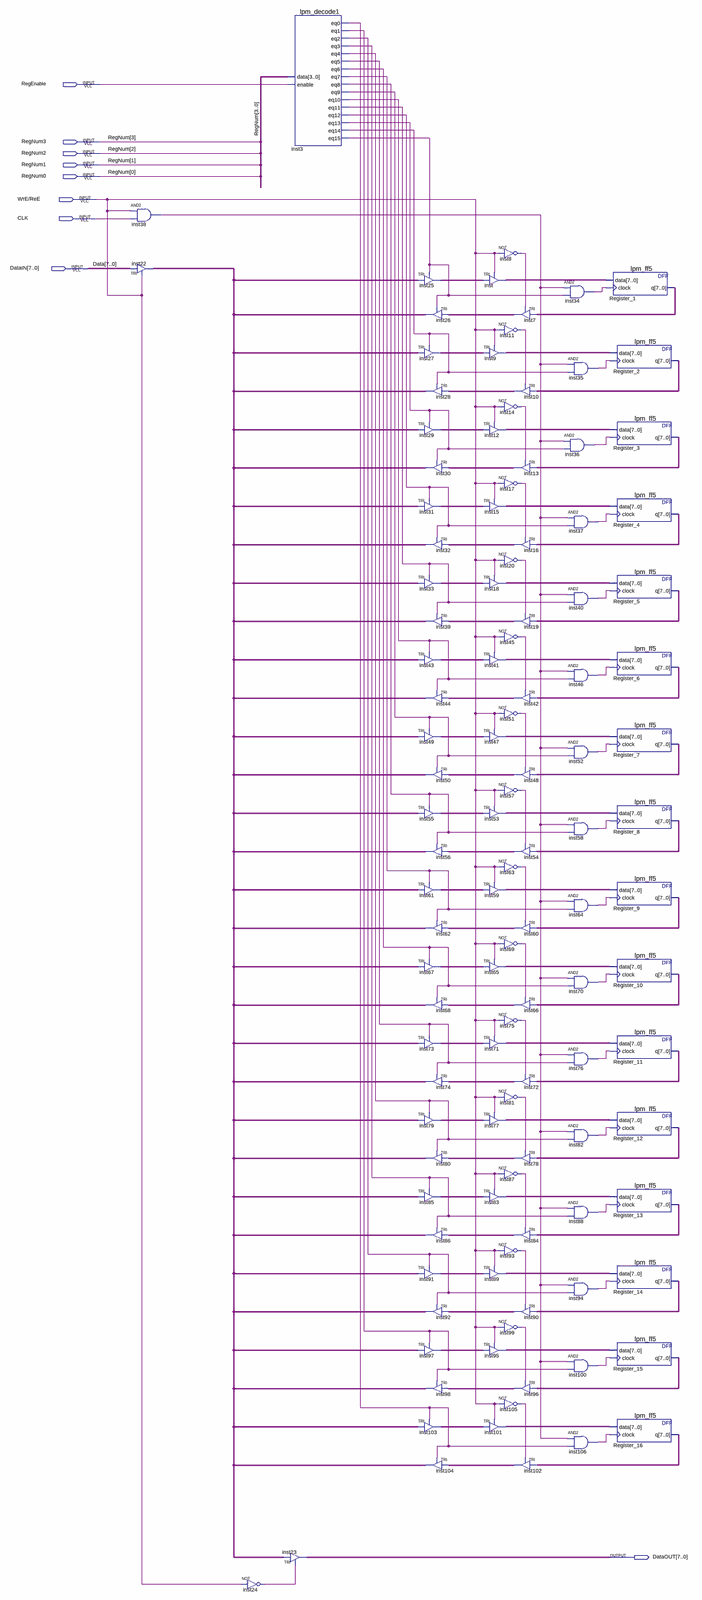
[diagram p0: schematic sheet, whole]
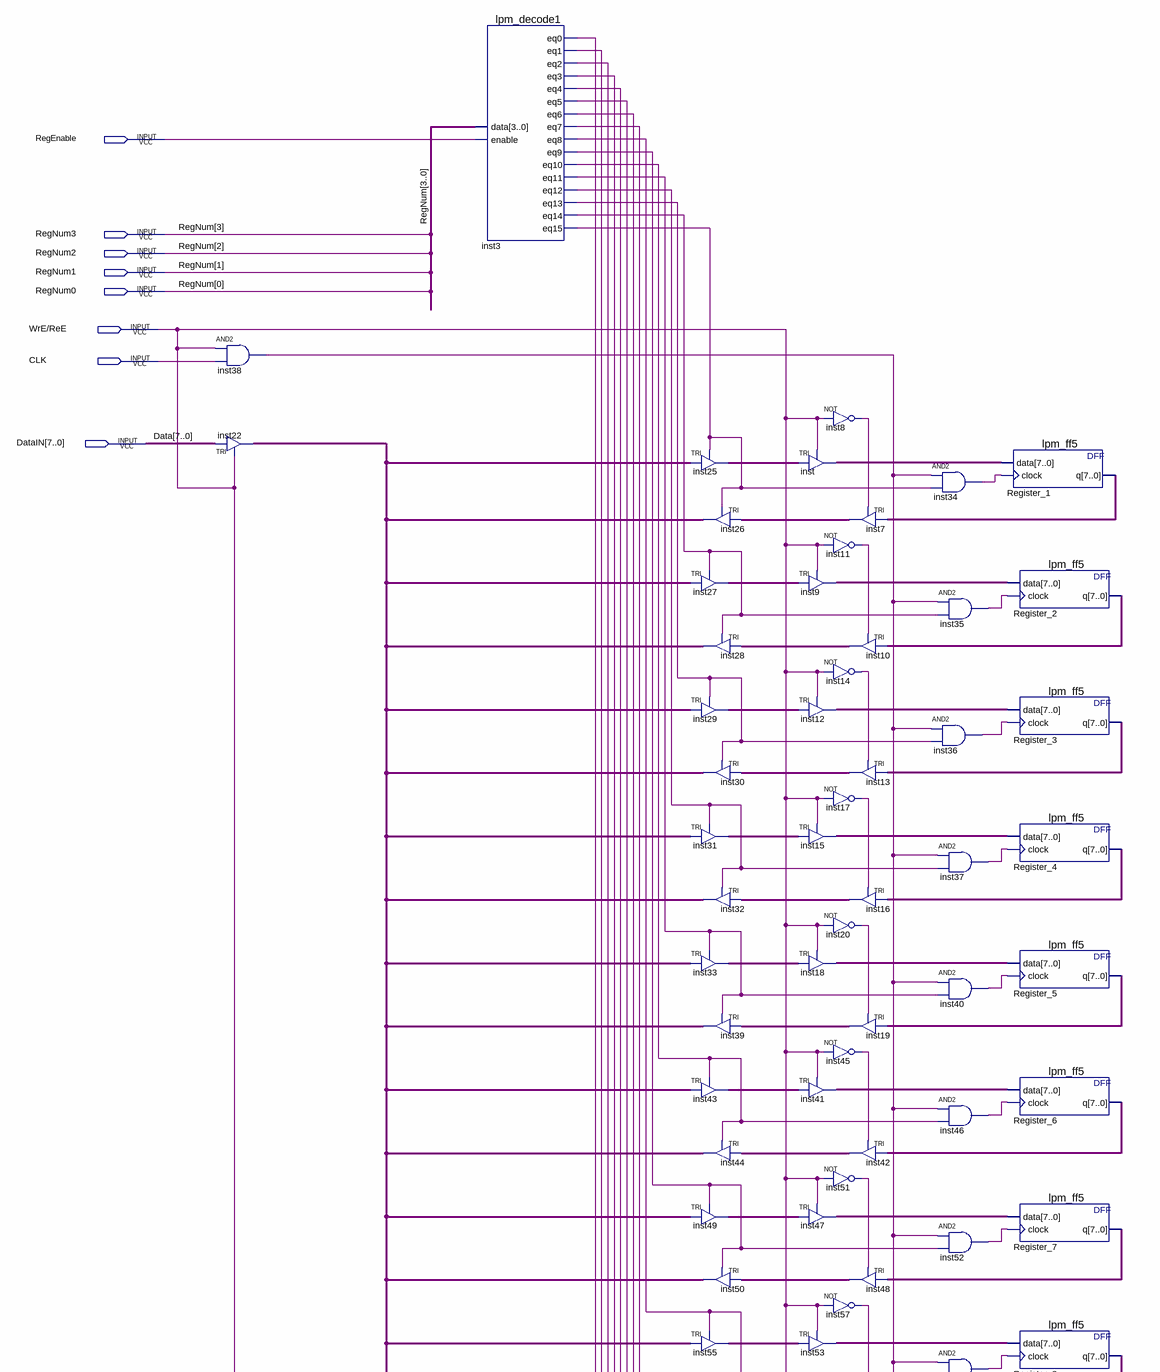
[diagram p1: schematic sheet, upper part]
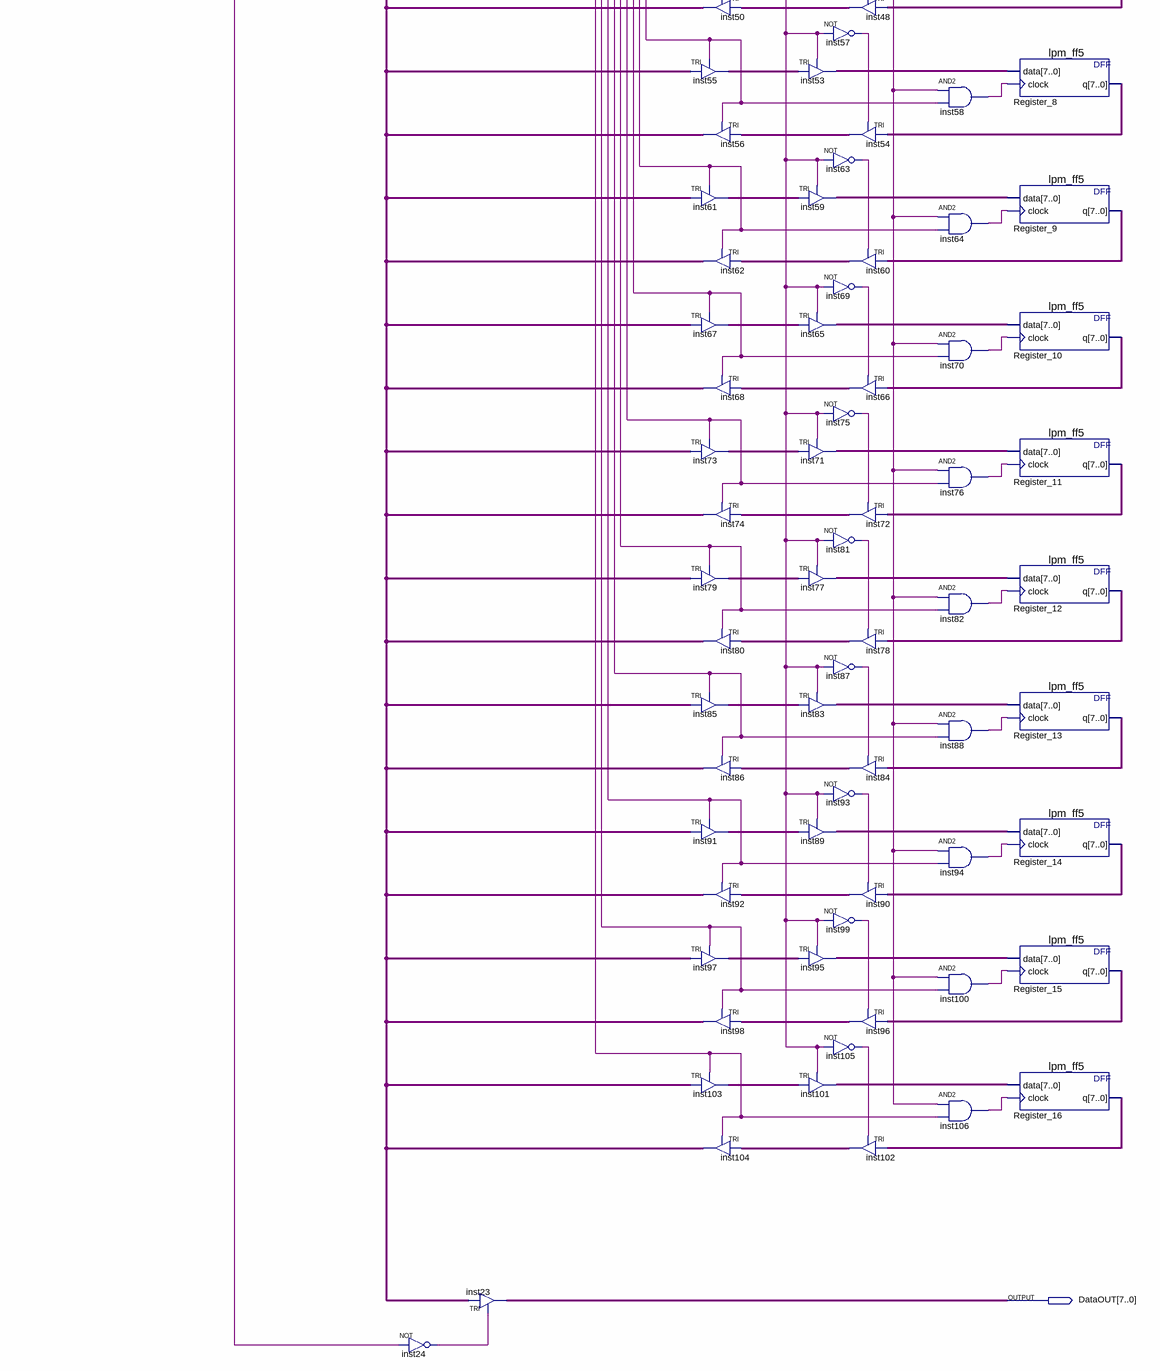
[diagram p2: schematic sheet, lower part]
// Quartus schematic Registers.bdf as structural Verilog: 117 symbols, 9 pins
module Registers (
  input  RegEnable,
  input  RegNum3,
  input  RegNum2,
  input  RegNum1,
  input  RegNum0,
  input  \WrE/ReE ,
  input  CLK,
  input  [7:0] DataIN,
  output [7:0] DataOUT
);

  wire inst3_eq0, inst3_eq1, inst3_eq2, inst3_eq3, inst3_eq4, inst3_eq5, inst3_eq6, inst3_eq7, inst3_eq8,
       inst3_eq9, inst3_eq10, inst3_eq11, inst3_eq12, inst3_eq13, inst3_eq14, inst3_eq15, inst8_out,
       inst11_out, inst14_out, inst17_out, inst20_out, inst24_out, inst34_out, inst35_out, inst36_out,
       inst37_out, inst38_out, inst40_out, inst45_out, inst46_out, inst51_out, inst52_out, inst57_out,
       inst58_out, inst63_out, inst64_out, inst69_out, inst70_out, inst75_out, inst76_out, inst81_out,
       inst82_out, inst87_out, inst88_out, inst93_out, inst94_out, inst99_out, inst100_out, inst105_out,
       inst106_out;
  wire [7:0] Data, inst7_out, inst9_out, inst10_out, inst12_out, inst13_out, inst15_out, inst16_out,
       inst18_out, inst19_out, inst25_out, inst27_out, inst29_out, inst31_out, inst33_out, inst41_out,
       inst42_out, inst43_out, inst47_out, inst48_out, inst49_out, inst53_out, inst54_out, inst55_out,
       inst59_out, inst60_out, inst61_out, inst65_out, inst66_out, inst67_out, inst71_out, inst72_out,
       inst73_out, inst77_out, inst78_out, inst79_out, inst83_out, inst84_out, inst85_out, inst89_out,
       inst90_out, inst91_out, inst95_out, inst96_out, inst97_out, inst101_out, inst102_out, inst103_out,
       inst_out, Register_1_q, Register_2_q, Register_3_q, Register_4_q, Register_5_q, Register_6_q,
       Register_7_q, Register_8_q, Register_9_q, Register_10_q, Register_11_q, Register_12_q, Register_13_q,
       Register_14_q, Register_15_q, Register_16_q;

  and inst38 (inst38_out, \WrE/ReE , CLK);
  TRI inst22[7:0] (.IN(DataIN), .OE(\WrE/ReE ), .OUT(Data));
  not inst24 (inst24_out, \WrE/ReE );
  lpm_decode1 inst3 (
    .data({RegNum3, RegNum2, RegNum1, RegNum0}), .enable(RegEnable), .eq0(inst3_eq0), .eq1(inst3_eq1),
    .eq2(inst3_eq2), .eq3(inst3_eq3), .eq4(inst3_eq4), .eq5(inst3_eq5), .eq6(inst3_eq6), .eq7(inst3_eq7),
    .eq8(inst3_eq8), .eq9(inst3_eq9), .eq10(inst3_eq10), .eq11(inst3_eq11), .eq12(inst3_eq12),
    .eq13(inst3_eq13), .eq14(inst3_eq14), .eq15(inst3_eq15));
  TRI inst23[7:0] (.IN(Data), .OE(inst24_out), .OUT(DataOUT));
  TRI inst25[7:0] (.IN(Data), .OE(inst3_eq15), .OUT(inst25_out));
  TRI inst27[7:0] (.IN(Data), .OE(inst3_eq14), .OUT(inst27_out));
  TRI inst29[7:0] (.IN(Data), .OE(inst3_eq13), .OUT(inst29_out));
  TRI inst31[7:0] (.IN(Data), .OE(inst3_eq12), .OUT(inst31_out));
  TRI inst33[7:0] (.IN(Data), .OE(inst3_eq11), .OUT(inst33_out));
  TRI inst43[7:0] (.IN(Data), .OE(inst3_eq10), .OUT(inst43_out));
  TRI inst49[7:0] (.IN(Data), .OE(inst3_eq9), .OUT(inst49_out));
  TRI inst55[7:0] (.IN(Data), .OE(inst3_eq8), .OUT(inst55_out));
  TRI inst61[7:0] (.IN(Data), .OE(inst3_eq7), .OUT(inst61_out));
  TRI inst67[7:0] (.IN(Data), .OE(inst3_eq6), .OUT(inst67_out));
  TRI inst73[7:0] (.IN(Data), .OE(inst3_eq5), .OUT(inst73_out));
  TRI inst79[7:0] (.IN(Data), .OE(inst3_eq4), .OUT(inst79_out));
  TRI inst85[7:0] (.IN(Data), .OE(inst3_eq3), .OUT(inst85_out));
  TRI inst91[7:0] (.IN(Data), .OE(inst3_eq2), .OUT(inst91_out));
  TRI inst97[7:0] (.IN(Data), .OE(inst3_eq1), .OUT(inst97_out));
  TRI inst103[7:0] (.IN(Data), .OE(inst3_eq0), .OUT(inst103_out));
  TRI inst26[7:0] (.IN(inst7_out), .OE(inst3_eq15), .OUT(Data));
  TRI inst28[7:0] (.IN(inst10_out), .OE(inst3_eq14), .OUT(Data));
  TRI inst30[7:0] (.IN(inst13_out), .OE(inst3_eq13), .OUT(Data));
  TRI inst32[7:0] (.IN(inst16_out), .OE(inst3_eq12), .OUT(Data));
  TRI inst39[7:0] (.IN(inst19_out), .OE(inst3_eq11), .OUT(Data));
  TRI inst44[7:0] (.IN(inst42_out), .OE(inst3_eq10), .OUT(Data));
  TRI inst50[7:0] (.IN(inst48_out), .OE(inst3_eq9), .OUT(Data));
  TRI inst56[7:0] (.IN(inst54_out), .OE(inst3_eq8), .OUT(Data));
  TRI inst62[7:0] (.IN(inst60_out), .OE(inst3_eq7), .OUT(Data));
  TRI inst68[7:0] (.IN(inst66_out), .OE(inst3_eq6), .OUT(Data));
  TRI inst74[7:0] (.IN(inst72_out), .OE(inst3_eq5), .OUT(Data));
  TRI inst80[7:0] (.IN(inst78_out), .OE(inst3_eq4), .OUT(Data));
  TRI inst86[7:0] (.IN(inst84_out), .OE(inst3_eq3), .OUT(Data));
  TRI inst92[7:0] (.IN(inst90_out), .OE(inst3_eq2), .OUT(Data));
  TRI inst98[7:0] (.IN(inst96_out), .OE(inst3_eq1), .OUT(Data));
  TRI inst104[7:0] (.IN(inst102_out), .OE(inst3_eq0), .OUT(Data));
  TRI inst[7:0] (.IN(inst25_out), .OE(\WrE/ReE ), .OUT(inst_out));
  TRI inst9[7:0] (.IN(inst27_out), .OE(\WrE/ReE ), .OUT(inst9_out));
  TRI inst12[7:0] (.IN(inst29_out), .OE(\WrE/ReE ), .OUT(inst12_out));
  TRI inst15[7:0] (.IN(inst31_out), .OE(\WrE/ReE ), .OUT(inst15_out));
  TRI inst18[7:0] (.IN(inst33_out), .OE(\WrE/ReE ), .OUT(inst18_out));
  TRI inst41[7:0] (.IN(inst43_out), .OE(\WrE/ReE ), .OUT(inst41_out));
  TRI inst47[7:0] (.IN(inst49_out), .OE(\WrE/ReE ), .OUT(inst47_out));
  TRI inst53[7:0] (.IN(inst55_out), .OE(\WrE/ReE ), .OUT(inst53_out));
  TRI inst59[7:0] (.IN(inst61_out), .OE(\WrE/ReE ), .OUT(inst59_out));
  TRI inst65[7:0] (.IN(inst67_out), .OE(\WrE/ReE ), .OUT(inst65_out));
  TRI inst71[7:0] (.IN(inst73_out), .OE(\WrE/ReE ), .OUT(inst71_out));
  TRI inst77[7:0] (.IN(inst79_out), .OE(\WrE/ReE ), .OUT(inst77_out));
  TRI inst83[7:0] (.IN(inst85_out), .OE(\WrE/ReE ), .OUT(inst83_out));
  TRI inst89[7:0] (.IN(inst91_out), .OE(\WrE/ReE ), .OUT(inst89_out));
  TRI inst95[7:0] (.IN(inst97_out), .OE(\WrE/ReE ), .OUT(inst95_out));
  TRI inst101[7:0] (.IN(inst103_out), .OE(\WrE/ReE ), .OUT(inst101_out));
  not inst8 (inst8_out, \WrE/ReE );
  TRI inst7[7:0] (.IN(Register_1_q), .OE(inst8_out), .OUT(inst7_out));
  not inst11 (inst11_out, \WrE/ReE );
  TRI inst10[7:0] (.IN(Register_2_q), .OE(inst11_out), .OUT(inst10_out));
  not inst14 (inst14_out, \WrE/ReE );
  TRI inst13[7:0] (.IN(Register_3_q), .OE(inst14_out), .OUT(inst13_out));
  not inst17 (inst17_out, \WrE/ReE );
  TRI inst16[7:0] (.IN(Register_4_q), .OE(inst17_out), .OUT(inst16_out));
  not inst20 (inst20_out, \WrE/ReE );
  TRI inst19[7:0] (.IN(Register_5_q), .OE(inst20_out), .OUT(inst19_out));
  not inst45 (inst45_out, \WrE/ReE );
  TRI inst42[7:0] (.IN(Register_6_q), .OE(inst45_out), .OUT(inst42_out));
  not inst51 (inst51_out, \WrE/ReE );
  TRI inst48[7:0] (.IN(Register_7_q), .OE(inst51_out), .OUT(inst48_out));
  not inst57 (inst57_out, \WrE/ReE );
  TRI inst54[7:0] (.IN(Register_8_q), .OE(inst57_out), .OUT(inst54_out));
  not inst63 (inst63_out, \WrE/ReE );
  TRI inst60[7:0] (.IN(Register_9_q), .OE(inst63_out), .OUT(inst60_out));
  not inst69 (inst69_out, \WrE/ReE );
  TRI inst66[7:0] (.IN(Register_10_q), .OE(inst69_out), .OUT(inst66_out));
  not inst75 (inst75_out, \WrE/ReE );
  TRI inst72[7:0] (.IN(Register_11_q), .OE(inst75_out), .OUT(inst72_out));
  not inst81 (inst81_out, \WrE/ReE );
  TRI inst78[7:0] (.IN(Register_12_q), .OE(inst81_out), .OUT(inst78_out));
  not inst87 (inst87_out, \WrE/ReE );
  TRI inst84[7:0] (.IN(Register_13_q), .OE(inst87_out), .OUT(inst84_out));
  not inst93 (inst93_out, \WrE/ReE );
  TRI inst90[7:0] (.IN(Register_14_q), .OE(inst93_out), .OUT(inst90_out));
  not inst99 (inst99_out, \WrE/ReE );
  TRI inst96[7:0] (.IN(Register_15_q), .OE(inst99_out), .OUT(inst96_out));
  not inst105 (inst105_out, \WrE/ReE );
  TRI inst102[7:0] (.IN(Register_16_q), .OE(inst105_out), .OUT(inst102_out));
  and inst34 (inst34_out, inst38_out, inst3_eq15);
  and inst35 (inst35_out, inst38_out, inst3_eq14);
  and inst36 (inst36_out, inst38_out, inst3_eq13);
  and inst37 (inst37_out, inst38_out, inst3_eq12);
  and inst40 (inst40_out, inst38_out, inst3_eq11);
  and inst46 (inst46_out, inst38_out, inst3_eq10);
  and inst52 (inst52_out, inst38_out, inst3_eq9);
  and inst58 (inst58_out, inst38_out, inst3_eq8);
  and inst64 (inst64_out, inst38_out, inst3_eq7);
  and inst70 (inst70_out, inst38_out, inst3_eq6);
  and inst76 (inst76_out, inst38_out, inst3_eq5);
  and inst82 (inst82_out, inst38_out, inst3_eq4);
  and inst88 (inst88_out, inst38_out, inst3_eq3);
  and inst94 (inst94_out, inst38_out, inst3_eq2);
  and inst100 (inst100_out, inst38_out, inst3_eq1);
  and inst106 (inst106_out, inst38_out, inst3_eq0);
  lpm_ff5 Register_1 (.data(inst_out), .clock(inst34_out), .q(Register_1_q));
  lpm_ff5 Register_2 (.data(inst9_out), .clock(inst35_out), .q(Register_2_q));
  lpm_ff5 Register_3 (.data(inst12_out), .clock(inst36_out), .q(Register_3_q));
  lpm_ff5 Register_4 (.data(inst15_out), .clock(inst37_out), .q(Register_4_q));
  lpm_ff5 Register_5 (.data(inst18_out), .clock(inst40_out), .q(Register_5_q));
  lpm_ff5 Register_6 (.data(inst41_out), .clock(inst46_out), .q(Register_6_q));
  lpm_ff5 Register_7 (.data(inst47_out), .clock(inst52_out), .q(Register_7_q));
  lpm_ff5 Register_8 (.data(inst53_out), .clock(inst58_out), .q(Register_8_q));
  lpm_ff5 Register_9 (.data(inst59_out), .clock(inst64_out), .q(Register_9_q));
  lpm_ff5 Register_10 (.data(inst65_out), .clock(inst70_out), .q(Register_10_q));
  lpm_ff5 Register_11 (.data(inst71_out), .clock(inst76_out), .q(Register_11_q));
  lpm_ff5 Register_12 (.data(inst77_out), .clock(inst82_out), .q(Register_12_q));
  lpm_ff5 Register_13 (.data(inst83_out), .clock(inst88_out), .q(Register_13_q));
  lpm_ff5 Register_14 (.data(inst89_out), .clock(inst94_out), .q(Register_14_q));
  lpm_ff5 Register_15 (.data(inst95_out), .clock(inst100_out), .q(Register_15_q));
  lpm_ff5 Register_16 (.data(inst101_out), .clock(inst106_out), .q(Register_16_q));
endmodule
